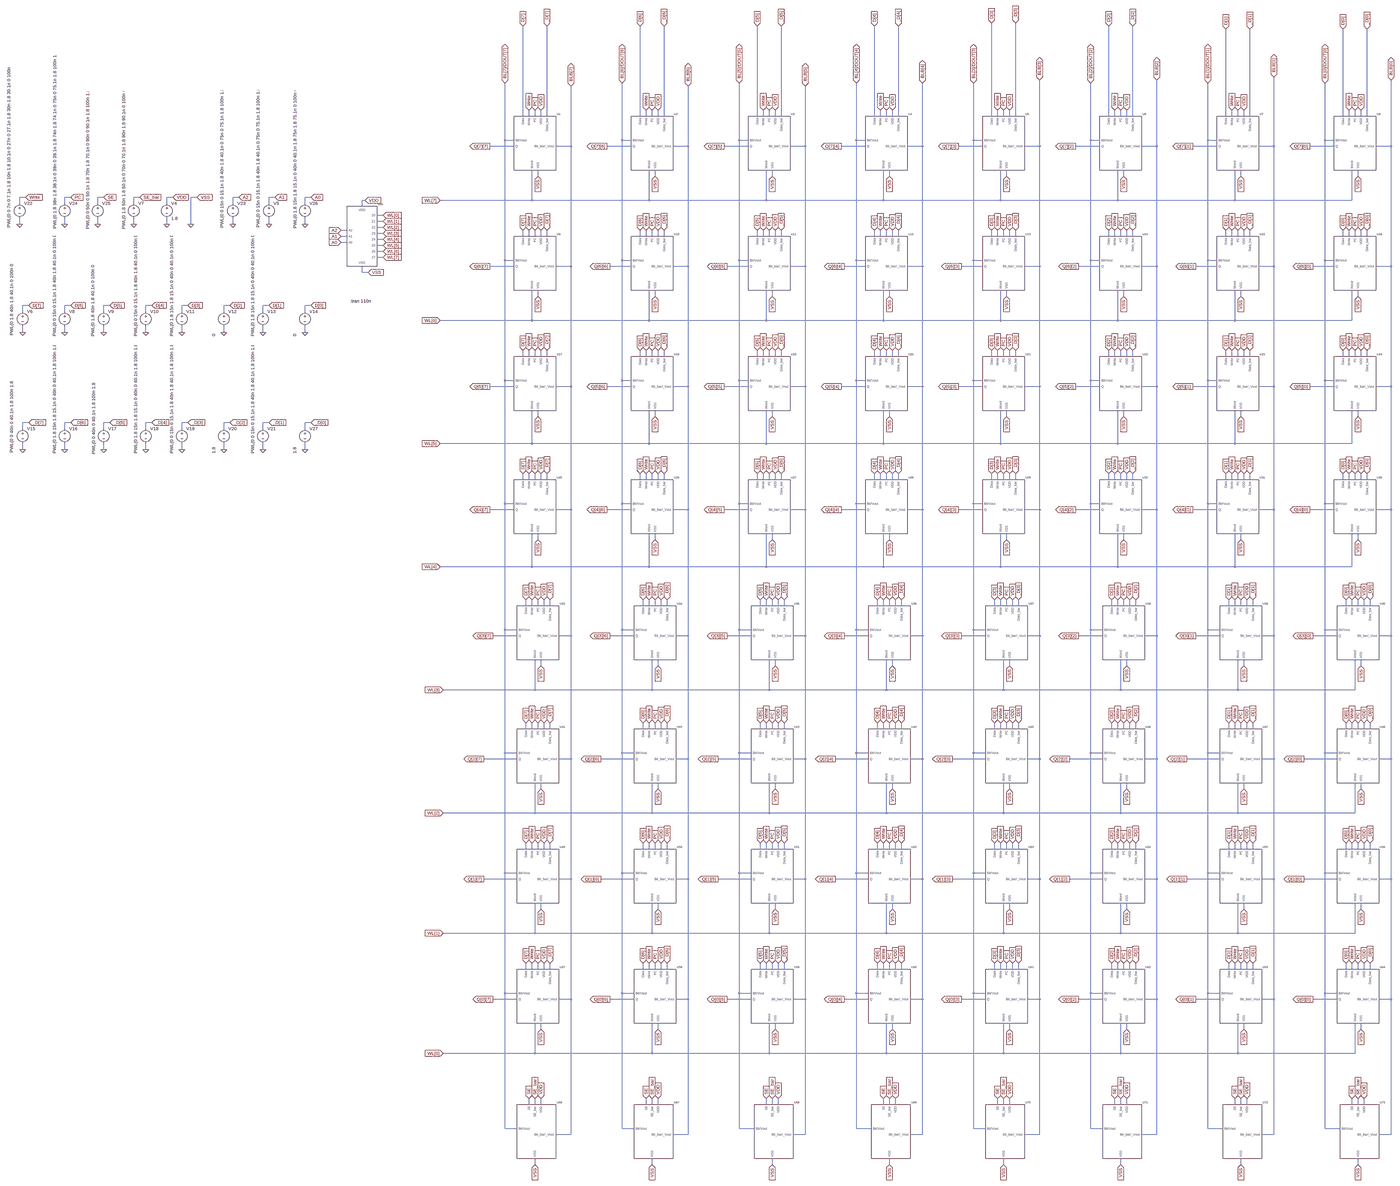
[diagram p0: schematic 8x8_Array.asc, whole sheet]
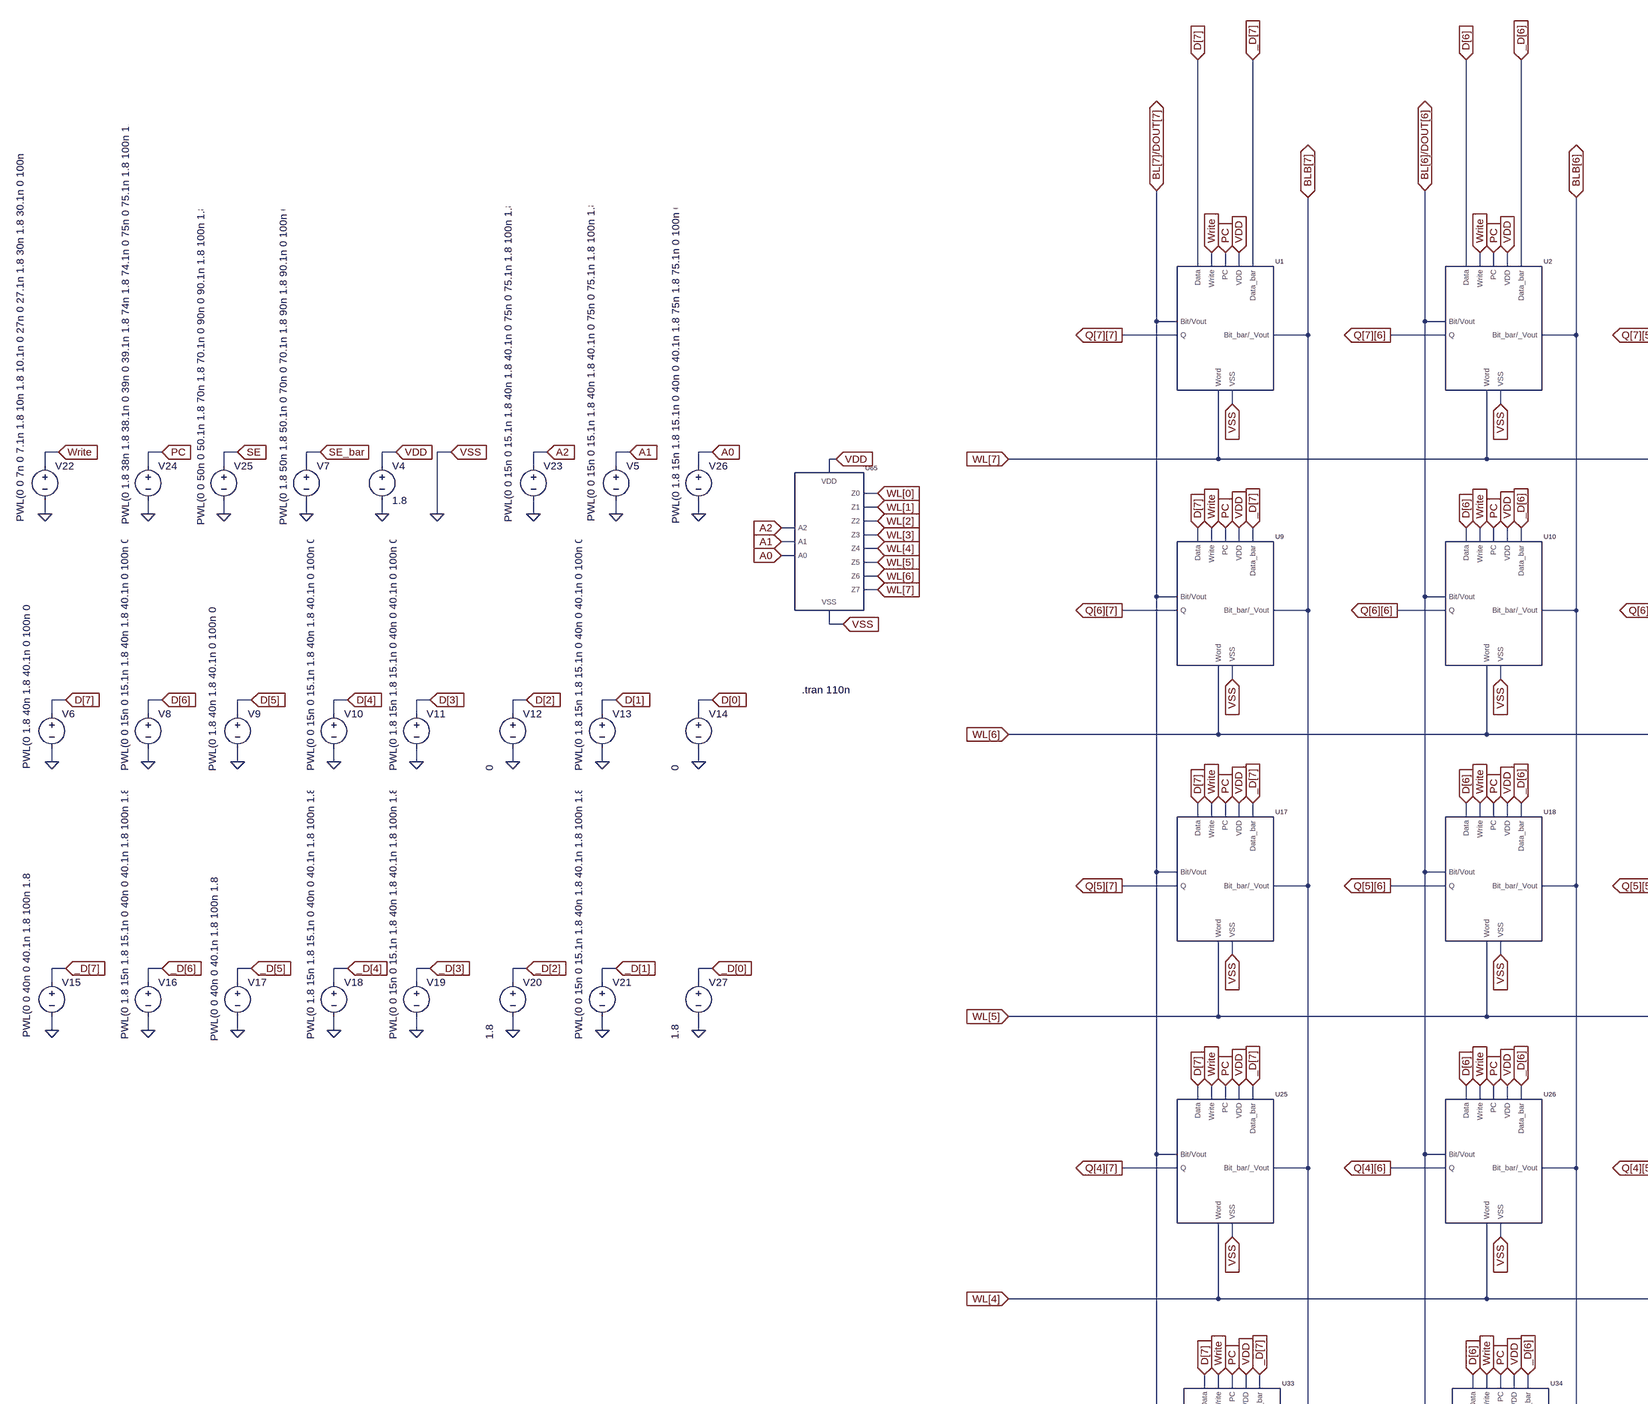
[diagram p1: schematic 8x8_Array.asc, part, row 1 of 2, column 1 of 2]
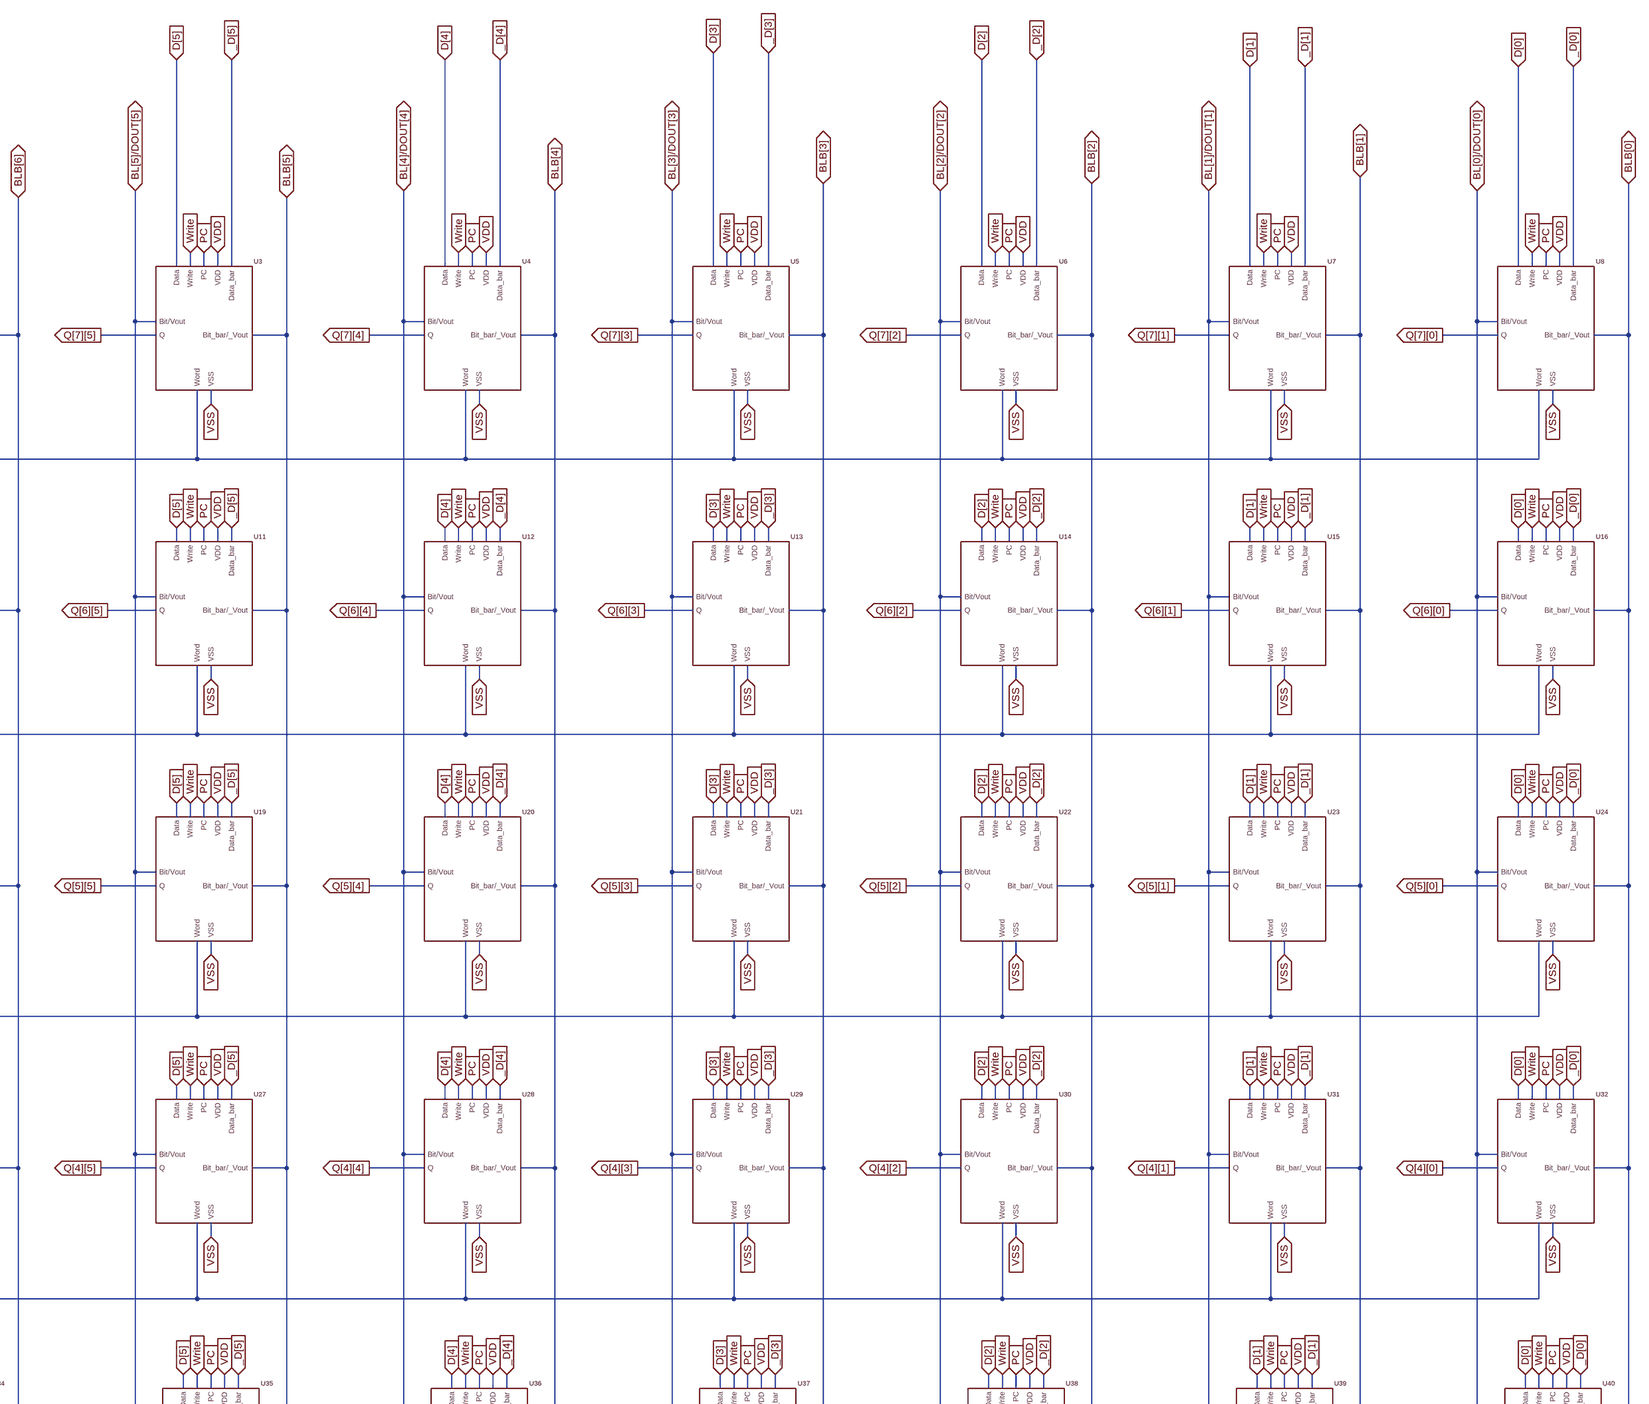
[diagram p2: schematic 8x8_Array.asc, part, row 1 of 2, column 2 of 2]
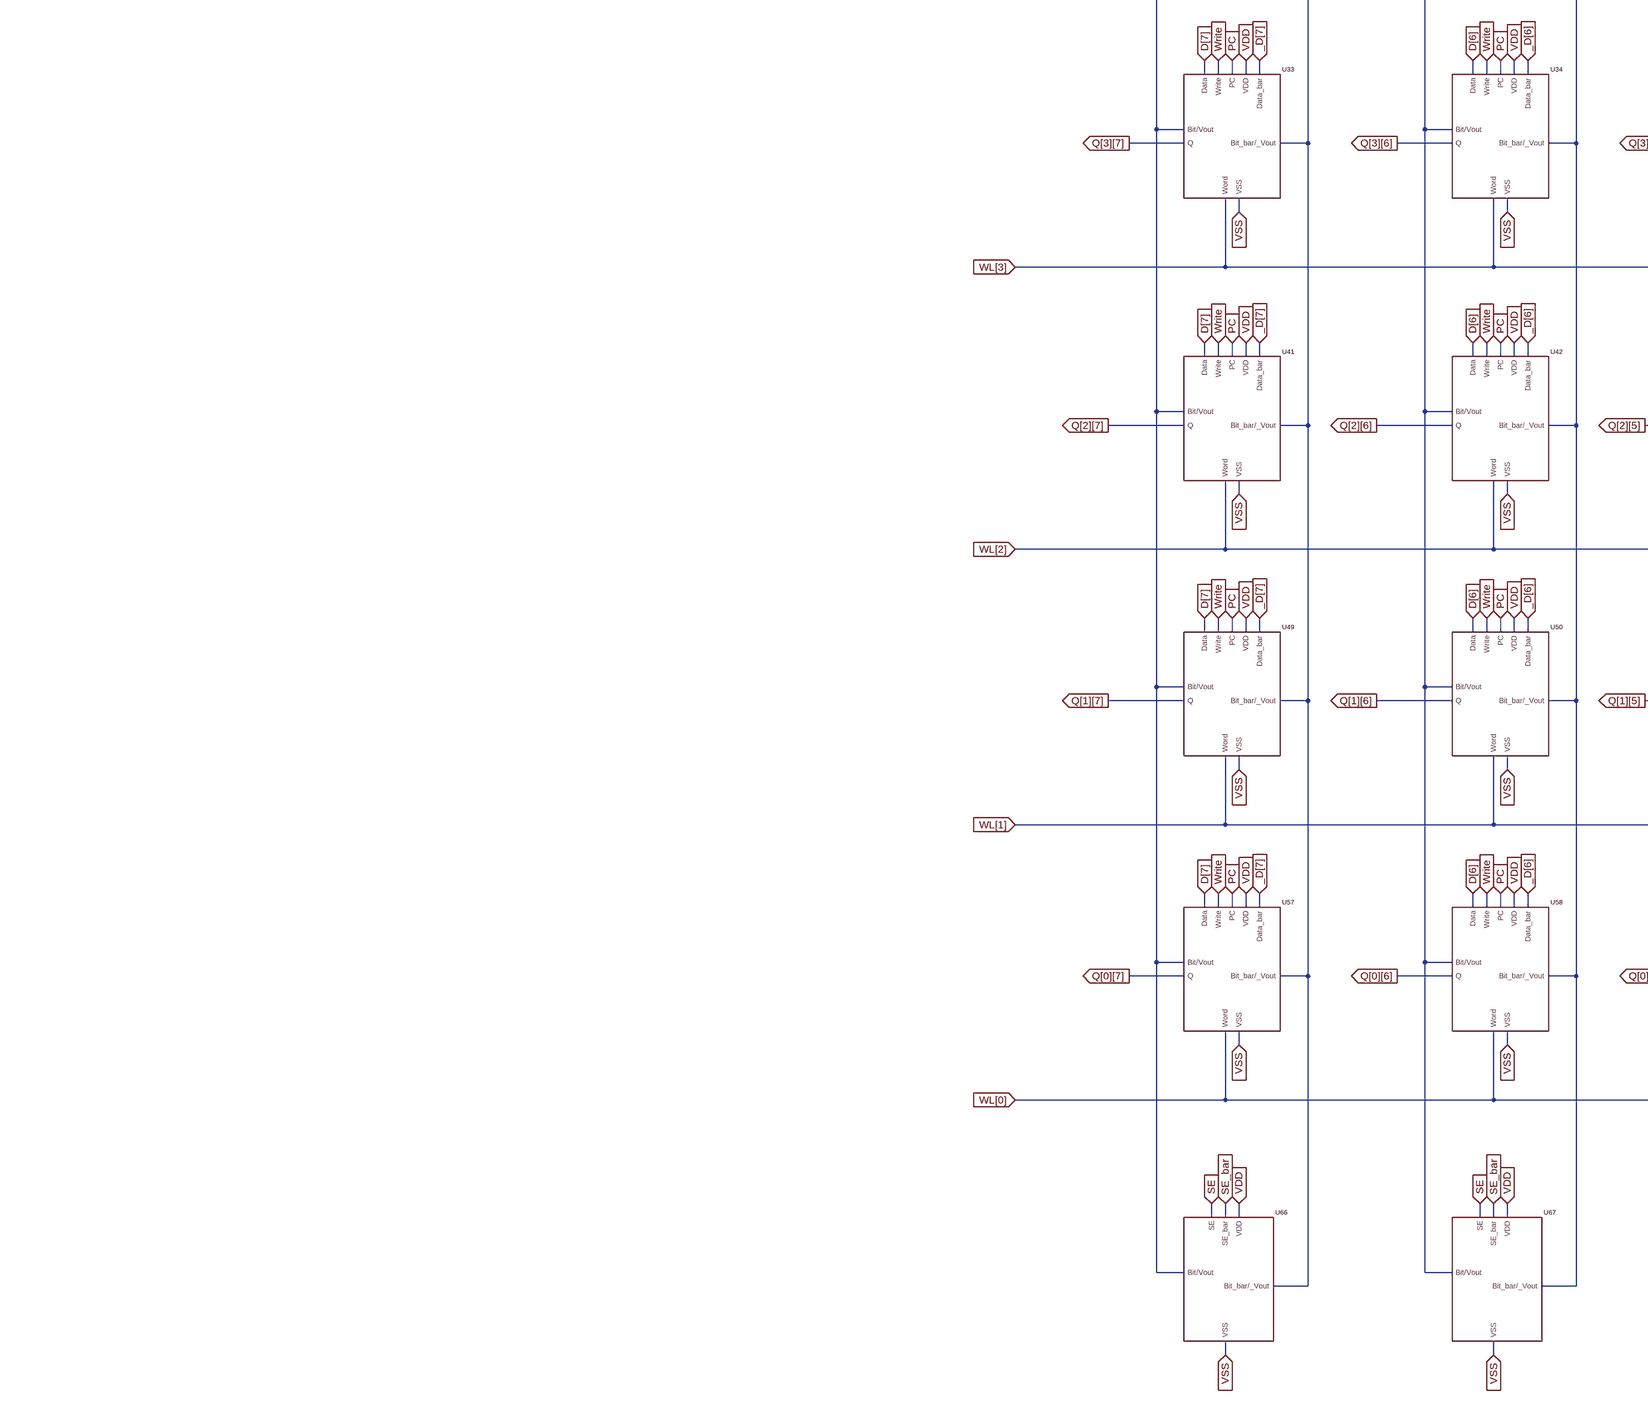
[diagram p3: schematic 8x8_Array.asc, part, row 2 of 2, column 1 of 2]
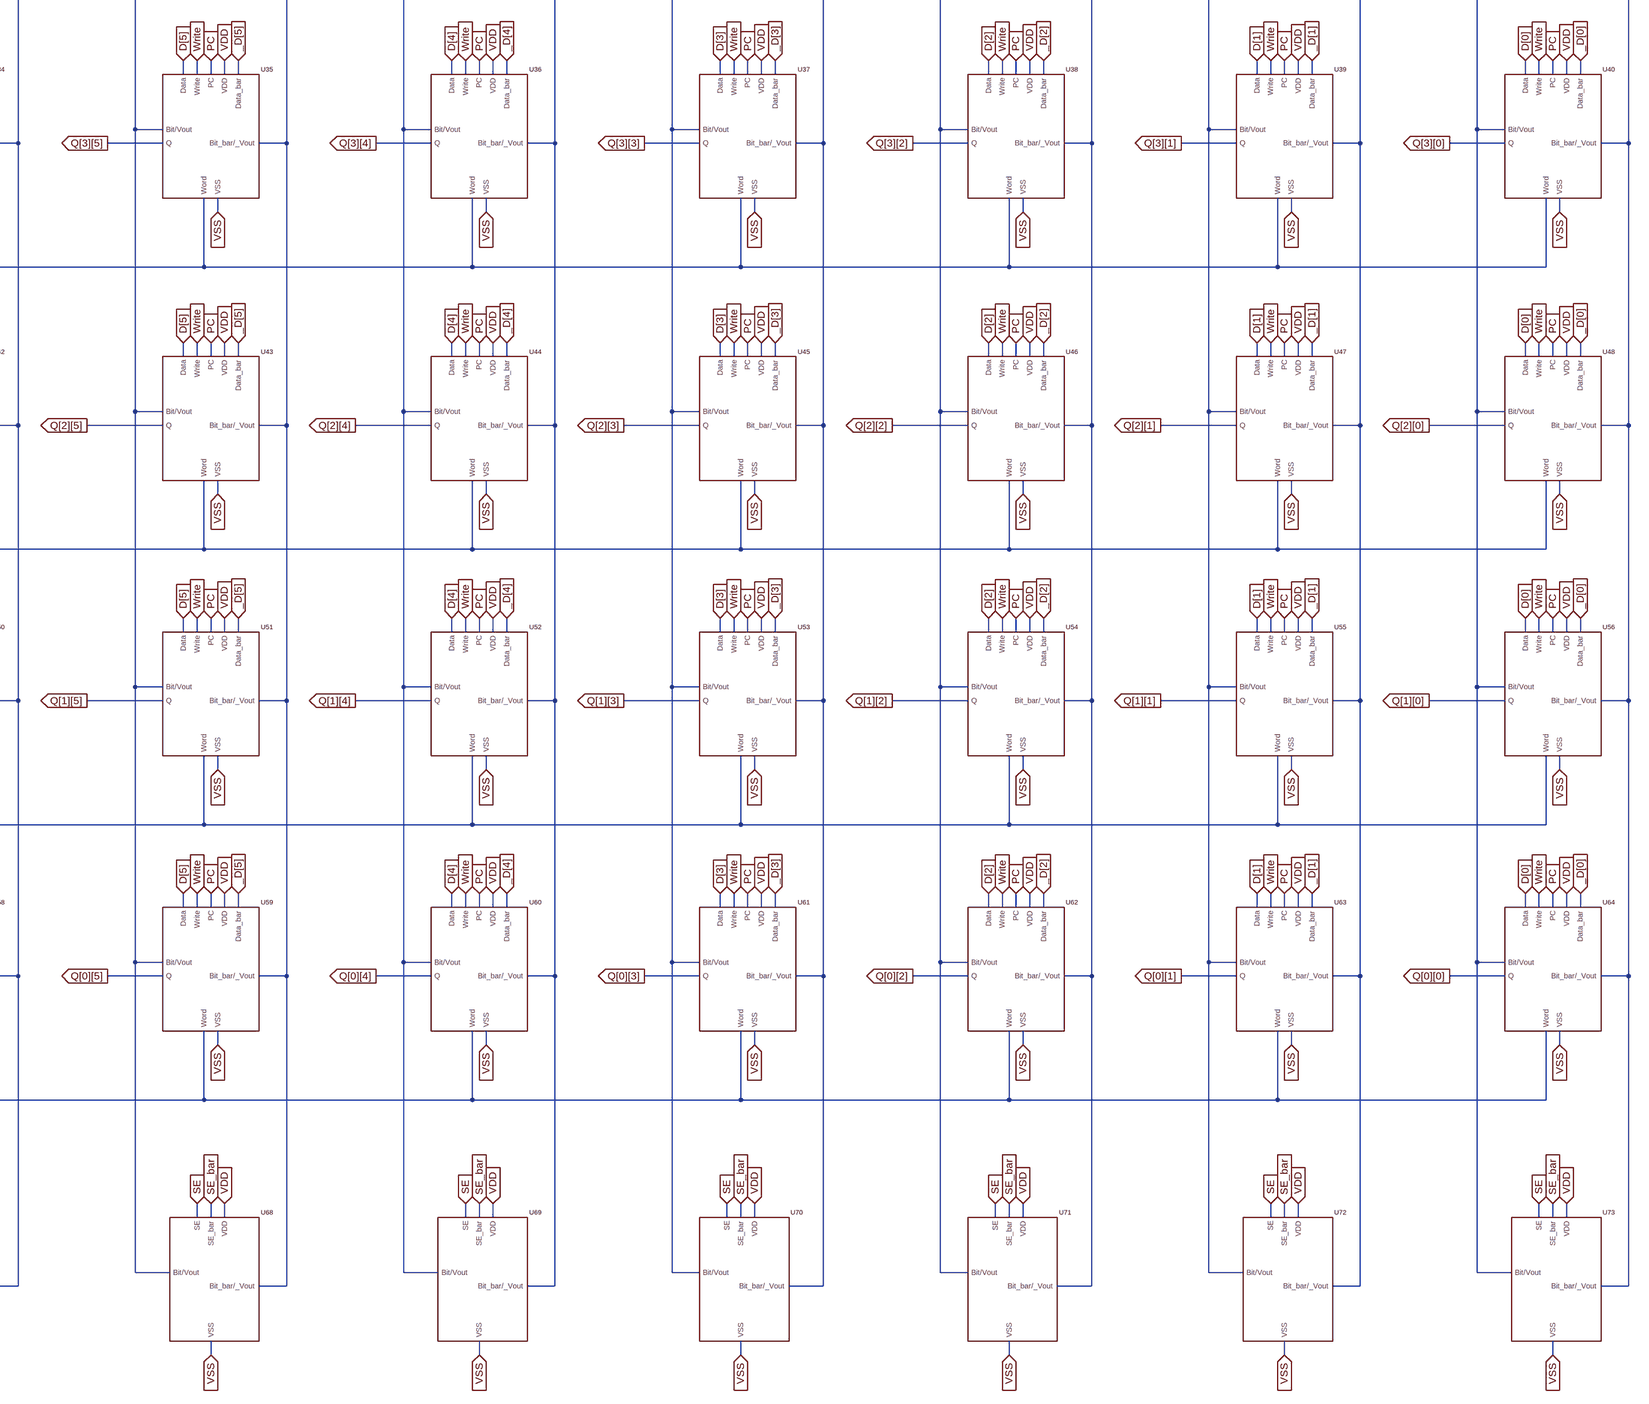
[diagram p4: schematic 8x8_Array.asc, part, row 2 of 2, column 2 of 2]
* 8x8_Array.asc
X§U1 D[7] Write PC VDD _D[7] WL[7] 0 BL[7]/DOUT[7] Q[7][7] BLB[7] 1-bit_6T_SRAM_Cell  ; pins Data Write PC VDD Data_bar Word VSS Bit/Vout Q Bit_bar/_Vout
X§U65 A2 A1 A0 WL[0] WL[1] WL[2] WL[3] WL[4] WL[5] WL[6] WL[7] VDD 0 3_to_8_Row_Decoder  ; pins A2 A1 A0 Z0 Z1 Z2 Z3 Z4 Z5 Z6 Z7 VDD VSS
X§U2 D[6] Write PC VDD _D[6] WL[7] 0 BL[6]/DOUT[6] Q[7][6] BLB[6] 1-bit_6T_SRAM_Cell  ; pins Data Write PC VDD Data_bar Word VSS Bit/Vout Q Bit_bar/_Vout
X§U3 D[5] Write PC VDD _D[5] WL[7] 0 BL[5]/DOUT[5] Q[7][5] BLB[5] 1-bit_6T_SRAM_Cell  ; pins Data Write PC VDD Data_bar Word VSS Bit/Vout Q Bit_bar/_Vout
X§U4 D[4] Write PC VDD _D[4] WL[7] 0 BL[4]/DOUT[4] Q[7][4] BLB[4] 1-bit_6T_SRAM_Cell  ; pins Data Write PC VDD Data_bar Word VSS Bit/Vout Q Bit_bar/_Vout
X§U5 D[3] Write PC VDD _D[3] WL[7] 0 BL[3]/DOUT[3] Q[7][3] BLB[3] 1-bit_6T_SRAM_Cell  ; pins Data Write PC VDD Data_bar Word VSS Bit/Vout Q Bit_bar/_Vout
X§U6 D[2] Write PC VDD _D[2] WL[7] 0 BL[2]/DOUT[2] Q[7][2] BLB[2] 1-bit_6T_SRAM_Cell  ; pins Data Write PC VDD Data_bar Word VSS Bit/Vout Q Bit_bar/_Vout
X§U7 D[1] Write PC VDD _D[1] WL[7] 0 BL[1]/DOUT[1] Q[7][1] BLB[1] 1-bit_6T_SRAM_Cell  ; pins Data Write PC VDD Data_bar Word VSS Bit/Vout Q Bit_bar/_Vout
X§U8 D[0] Write PC VDD _D[0] WL[7] 0 BL[0]/DOUT[0] Q[7][0] BLB[0] 1-bit_6T_SRAM_Cell  ; pins Data Write PC VDD Data_bar Word VSS Bit/Vout Q Bit_bar/_Vout
X§U9 D[7] Write PC VDD _D[7] WL[6] 0 BL[7]/DOUT[7] Q[6][7] BLB[7] 1-bit_6T_SRAM_Cell  ; pins Data Write PC VDD Data_bar Word VSS Bit/Vout Q Bit_bar/_Vout
X§U10 D[6] Write PC VDD _D[6] WL[6] 0 BL[6]/DOUT[6] Q[6][6] BLB[6] 1-bit_6T_SRAM_Cell  ; pins Data Write PC VDD Data_bar Word VSS Bit/Vout Q Bit_bar/_Vout
X§U11 D[5] Write PC VDD _D[5] WL[6] 0 BL[5]/DOUT[5] Q[6][5] BLB[5] 1-bit_6T_SRAM_Cell  ; pins Data Write PC VDD Data_bar Word VSS Bit/Vout Q Bit_bar/_Vout
X§U12 D[4] Write PC VDD _D[4] WL[6] 0 BL[4]/DOUT[4] Q[6][4] BLB[4] 1-bit_6T_SRAM_Cell  ; pins Data Write PC VDD Data_bar Word VSS Bit/Vout Q Bit_bar/_Vout
X§U13 D[3] Write PC VDD _D[3] WL[6] 0 BL[3]/DOUT[3] Q[6][3] BLB[3] 1-bit_6T_SRAM_Cell  ; pins Data Write PC VDD Data_bar Word VSS Bit/Vout Q Bit_bar/_Vout
X§U14 D[2] Write PC VDD _D[2] WL[6] 0 BL[2]/DOUT[2] Q[6][2] BLB[2] 1-bit_6T_SRAM_Cell  ; pins Data Write PC VDD Data_bar Word VSS Bit/Vout Q Bit_bar/_Vout
X§U15 D[1] Write PC VDD _D[1] WL[6] 0 BL[1]/DOUT[1] Q[6][1] BLB[1] 1-bit_6T_SRAM_Cell  ; pins Data Write PC VDD Data_bar Word VSS Bit/Vout Q Bit_bar/_Vout
X§U16 D[0] Write PC VDD _D[0] WL[6] 0 BL[0]/DOUT[0] Q[6][0] BLB[0] 1-bit_6T_SRAM_Cell  ; pins Data Write PC VDD Data_bar Word VSS Bit/Vout Q Bit_bar/_Vout
X§U17 D[7] Write PC VDD _D[7] WL[5] 0 BL[7]/DOUT[7] Q[5][7] BLB[7] 1-bit_6T_SRAM_Cell  ; pins Data Write PC VDD Data_bar Word VSS Bit/Vout Q Bit_bar/_Vout
X§U18 D[6] Write PC VDD _D[6] WL[5] 0 BL[6]/DOUT[6] Q[5][6] BLB[6] 1-bit_6T_SRAM_Cell  ; pins Data Write PC VDD Data_bar Word VSS Bit/Vout Q Bit_bar/_Vout
X§U19 D[5] Write PC VDD _D[5] WL[5] 0 BL[5]/DOUT[5] Q[5][5] BLB[5] 1-bit_6T_SRAM_Cell  ; pins Data Write PC VDD Data_bar Word VSS Bit/Vout Q Bit_bar/_Vout
X§U20 D[4] Write PC VDD _D[4] WL[5] 0 BL[4]/DOUT[4] Q[5][4] BLB[4] 1-bit_6T_SRAM_Cell  ; pins Data Write PC VDD Data_bar Word VSS Bit/Vout Q Bit_bar/_Vout
X§U21 D[3] Write PC VDD _D[3] WL[5] 0 BL[3]/DOUT[3] Q[5][3] BLB[3] 1-bit_6T_SRAM_Cell  ; pins Data Write PC VDD Data_bar Word VSS Bit/Vout Q Bit_bar/_Vout
X§U22 D[2] Write PC VDD _D[2] WL[5] 0 BL[2]/DOUT[2] Q[5][2] BLB[2] 1-bit_6T_SRAM_Cell  ; pins Data Write PC VDD Data_bar Word VSS Bit/Vout Q Bit_bar/_Vout
X§U23 D[1] Write PC VDD _D[1] WL[5] 0 BL[1]/DOUT[1] Q[5][1] BLB[1] 1-bit_6T_SRAM_Cell  ; pins Data Write PC VDD Data_bar Word VSS Bit/Vout Q Bit_bar/_Vout
X§U24 D[0] Write PC VDD _D[0] WL[5] 0 BL[0]/DOUT[0] Q[5][0] BLB[0] 1-bit_6T_SRAM_Cell  ; pins Data Write PC VDD Data_bar Word VSS Bit/Vout Q Bit_bar/_Vout
X§U25 D[7] Write PC VDD _D[7] WL[4] 0 BL[7]/DOUT[7] Q[4][7] BLB[7] 1-bit_6T_SRAM_Cell  ; pins Data Write PC VDD Data_bar Word VSS Bit/Vout Q Bit_bar/_Vout
X§U26 D[6] Write PC VDD _D[6] WL[4] 0 BL[6]/DOUT[6] Q[4][6] BLB[6] 1-bit_6T_SRAM_Cell  ; pins Data Write PC VDD Data_bar Word VSS Bit/Vout Q Bit_bar/_Vout
X§U27 D[5] Write PC VDD _D[5] WL[4] 0 BL[5]/DOUT[5] Q[4][5] BLB[5] 1-bit_6T_SRAM_Cell  ; pins Data Write PC VDD Data_bar Word VSS Bit/Vout Q Bit_bar/_Vout
X§U28 D[4] Write PC VDD _D[4] WL[4] 0 BL[4]/DOUT[4] Q[4][4] BLB[4] 1-bit_6T_SRAM_Cell  ; pins Data Write PC VDD Data_bar Word VSS Bit/Vout Q Bit_bar/_Vout
X§U29 D[3] Write PC VDD _D[3] WL[4] 0 BL[3]/DOUT[3] Q[4][3] BLB[3] 1-bit_6T_SRAM_Cell  ; pins Data Write PC VDD Data_bar Word VSS Bit/Vout Q Bit_bar/_Vout
X§U30 D[2] Write PC VDD _D[2] WL[4] 0 BL[2]/DOUT[2] Q[4][2] BLB[2] 1-bit_6T_SRAM_Cell  ; pins Data Write PC VDD Data_bar Word VSS Bit/Vout Q Bit_bar/_Vout
X§U31 D[1] Write PC VDD _D[1] WL[4] 0 BL[1]/DOUT[1] Q[4][1] BLB[1] 1-bit_6T_SRAM_Cell  ; pins Data Write PC VDD Data_bar Word VSS Bit/Vout Q Bit_bar/_Vout
X§U32 D[0] Write PC VDD _D[0] WL[4] 0 BL[0]/DOUT[0] Q[4][0] BLB[0] 1-bit_6T_SRAM_Cell  ; pins Data Write PC VDD Data_bar Word VSS Bit/Vout Q Bit_bar/_Vout
X§U33 D[7] Write PC VDD _D[7] WL[3] 0 BL[7]/DOUT[7] Q[3][7] BLB[7] 1-bit_6T_SRAM_Cell  ; pins Data Write PC VDD Data_bar Word VSS Bit/Vout Q Bit_bar/_Vout
X§U34 D[6] Write PC VDD _D[6] WL[3] 0 BL[6]/DOUT[6] Q[3][6] BLB[6] 1-bit_6T_SRAM_Cell  ; pins Data Write PC VDD Data_bar Word VSS Bit/Vout Q Bit_bar/_Vout
X§U35 D[5] Write PC VDD _D[5] WL[3] 0 BL[5]/DOUT[5] Q[3][5] BLB[5] 1-bit_6T_SRAM_Cell  ; pins Data Write PC VDD Data_bar Word VSS Bit/Vout Q Bit_bar/_Vout
X§U36 D[4] Write PC VDD _D[4] WL[3] 0 BL[4]/DOUT[4] Q[3][4] BLB[4] 1-bit_6T_SRAM_Cell  ; pins Data Write PC VDD Data_bar Word VSS Bit/Vout Q Bit_bar/_Vout
X§U37 D[3] Write PC VDD _D[3] WL[3] 0 BL[3]/DOUT[3] Q[3][3] BLB[3] 1-bit_6T_SRAM_Cell  ; pins Data Write PC VDD Data_bar Word VSS Bit/Vout Q Bit_bar/_Vout
X§U38 D[2] Write PC VDD _D[2] WL[3] 0 BL[2]/DOUT[2] Q[3][2] BLB[2] 1-bit_6T_SRAM_Cell  ; pins Data Write PC VDD Data_bar Word VSS Bit/Vout Q Bit_bar/_Vout
X§U39 D[1] Write PC VDD _D[1] WL[3] 0 BL[1]/DOUT[1] Q[3][1] BLB[1] 1-bit_6T_SRAM_Cell  ; pins Data Write PC VDD Data_bar Word VSS Bit/Vout Q Bit_bar/_Vout
X§U40 D[0] Write PC VDD _D[0] WL[3] 0 BL[0]/DOUT[0] Q[3][0] BLB[0] 1-bit_6T_SRAM_Cell  ; pins Data Write PC VDD Data_bar Word VSS Bit/Vout Q Bit_bar/_Vout
X§U41 D[7] Write PC VDD _D[7] WL[2] 0 BL[7]/DOUT[7] Q[2][7] BLB[7] 1-bit_6T_SRAM_Cell  ; pins Data Write PC VDD Data_bar Word VSS Bit/Vout Q Bit_bar/_Vout
X§U42 D[6] Write PC VDD _D[6] WL[2] 0 BL[6]/DOUT[6] Q[2][6] BLB[6] 1-bit_6T_SRAM_Cell  ; pins Data Write PC VDD Data_bar Word VSS Bit/Vout Q Bit_bar/_Vout
X§U43 D[5] Write PC VDD _D[5] WL[2] 0 BL[5]/DOUT[5] Q[2][5] BLB[5] 1-bit_6T_SRAM_Cell  ; pins Data Write PC VDD Data_bar Word VSS Bit/Vout Q Bit_bar/_Vout
X§U44 D[4] Write PC VDD _D[4] WL[2] 0 BL[4]/DOUT[4] Q[2][4] BLB[4] 1-bit_6T_SRAM_Cell  ; pins Data Write PC VDD Data_bar Word VSS Bit/Vout Q Bit_bar/_Vout
X§U45 D[3] Write PC VDD _D[3] WL[2] 0 BL[3]/DOUT[3] Q[2][3] BLB[3] 1-bit_6T_SRAM_Cell  ; pins Data Write PC VDD Data_bar Word VSS Bit/Vout Q Bit_bar/_Vout
X§U46 D[2] Write PC VDD _D[2] WL[2] 0 BL[2]/DOUT[2] Q[2][2] BLB[2] 1-bit_6T_SRAM_Cell  ; pins Data Write PC VDD Data_bar Word VSS Bit/Vout Q Bit_bar/_Vout
X§U47 D[1] Write PC VDD _D[1] WL[2] 0 BL[1]/DOUT[1] Q[2][1] BLB[1] 1-bit_6T_SRAM_Cell  ; pins Data Write PC VDD Data_bar Word VSS Bit/Vout Q Bit_bar/_Vout
X§U48 D[0] Write PC VDD _D[0] WL[2] 0 BL[0]/DOUT[0] Q[2][0] BLB[0] 1-bit_6T_SRAM_Cell  ; pins Data Write PC VDD Data_bar Word VSS Bit/Vout Q Bit_bar/_Vout
X§U49 D[7] Write PC VDD _D[7] WL[1] 0 BL[7]/DOUT[7] Q[1][7] BLB[7] 1-bit_6T_SRAM_Cell  ; pins Data Write PC VDD Data_bar Word VSS Bit/Vout Q Bit_bar/_Vout
X§U50 D[6] Write PC VDD _D[6] WL[1] 0 BL[6]/DOUT[6] Q[1][6] BLB[6] 1-bit_6T_SRAM_Cell  ; pins Data Write PC VDD Data_bar Word VSS Bit/Vout Q Bit_bar/_Vout
X§U51 D[5] Write PC VDD _D[5] WL[1] 0 BL[5]/DOUT[5] Q[1][5] BLB[5] 1-bit_6T_SRAM_Cell  ; pins Data Write PC VDD Data_bar Word VSS Bit/Vout Q Bit_bar/_Vout
X§U52 D[4] Write PC VDD _D[4] WL[1] 0 BL[4]/DOUT[4] Q[1][4] BLB[4] 1-bit_6T_SRAM_Cell  ; pins Data Write PC VDD Data_bar Word VSS Bit/Vout Q Bit_bar/_Vout
X§U53 D[3] Write PC VDD _D[3] WL[1] 0 BL[3]/DOUT[3] Q[1][3] BLB[3] 1-bit_6T_SRAM_Cell  ; pins Data Write PC VDD Data_bar Word VSS Bit/Vout Q Bit_bar/_Vout
X§U54 D[2] Write PC VDD _D[2] WL[1] 0 BL[2]/DOUT[2] Q[1][2] BLB[2] 1-bit_6T_SRAM_Cell  ; pins Data Write PC VDD Data_bar Word VSS Bit/Vout Q Bit_bar/_Vout
X§U55 D[1] Write PC VDD _D[1] WL[1] 0 BL[1]/DOUT[1] Q[1][1] BLB[1] 1-bit_6T_SRAM_Cell  ; pins Data Write PC VDD Data_bar Word VSS Bit/Vout Q Bit_bar/_Vout
X§U56 D[0] Write PC VDD _D[0] WL[1] 0 BL[0]/DOUT[0] Q[1][0] BLB[0] 1-bit_6T_SRAM_Cell  ; pins Data Write PC VDD Data_bar Word VSS Bit/Vout Q Bit_bar/_Vout
X§U57 D[7] Write PC VDD _D[7] WL[0] 0 BL[7]/DOUT[7] Q[0][7] BLB[7] 1-bit_6T_SRAM_Cell  ; pins Data Write PC VDD Data_bar Word VSS Bit/Vout Q Bit_bar/_Vout
X§U58 D[6] Write PC VDD _D[6] WL[0] 0 BL[6]/DOUT[6] Q[0][6] BLB[6] 1-bit_6T_SRAM_Cell  ; pins Data Write PC VDD Data_bar Word VSS Bit/Vout Q Bit_bar/_Vout
X§U59 D[5] Write PC VDD _D[5] WL[0] 0 BL[5]/DOUT[5] Q[0][5] BLB[5] 1-bit_6T_SRAM_Cell  ; pins Data Write PC VDD Data_bar Word VSS Bit/Vout Q Bit_bar/_Vout
X§U60 D[4] Write PC VDD _D[4] WL[0] 0 BL[4]/DOUT[4] Q[0][4] BLB[4] 1-bit_6T_SRAM_Cell  ; pins Data Write PC VDD Data_bar Word VSS Bit/Vout Q Bit_bar/_Vout
X§U61 D[3] Write PC VDD _D[3] WL[0] 0 BL[3]/DOUT[3] Q[0][3] BLB[3] 1-bit_6T_SRAM_Cell  ; pins Data Write PC VDD Data_bar Word VSS Bit/Vout Q Bit_bar/_Vout
X§U62 D[2] Write PC VDD _D[2] WL[0] 0 BL[2]/DOUT[2] Q[0][2] BLB[2] 1-bit_6T_SRAM_Cell  ; pins Data Write PC VDD Data_bar Word VSS Bit/Vout Q Bit_bar/_Vout
X§U63 D[1] Write PC VDD _D[1] WL[0] 0 BL[1]/DOUT[1] Q[0][1] BLB[1] 1-bit_6T_SRAM_Cell  ; pins Data Write PC VDD Data_bar Word VSS Bit/Vout Q Bit_bar/_Vout
X§U64 D[0] Write PC VDD _D[0] WL[0] 0 BL[0]/DOUT[0] Q[0][0] BLB[0] 1-bit_6T_SRAM_Cell  ; pins Data Write PC VDD Data_bar Word VSS Bit/Vout Q Bit_bar/_Vout
X§U66 SE SE_bar VDD BL[7]/DOUT[7] BLB[7] 0 Sense_Amplifier  ; pins SE SE_bar VDD Bit/Vout Bit_bar/_Vout VSS
X§U67 SE SE_bar VDD BL[6]/DOUT[6] BLB[6] 0 Sense_Amplifier  ; pins SE SE_bar VDD Bit/Vout Bit_bar/_Vout VSS
X§U68 SE SE_bar VDD BL[5]/DOUT[5] BLB[5] 0 Sense_Amplifier  ; pins SE SE_bar VDD Bit/Vout Bit_bar/_Vout VSS
X§U69 SE SE_bar VDD BL[4]/DOUT[4] BLB[4] 0 Sense_Amplifier  ; pins SE SE_bar VDD Bit/Vout Bit_bar/_Vout VSS
X§U70 SE SE_bar VDD BL[3]/DOUT[3] BLB[3] 0 Sense_Amplifier  ; pins SE SE_bar VDD Bit/Vout Bit_bar/_Vout VSS
X§U71 SE SE_bar VDD BL[2]/DOUT[2] BLB[2] 0 Sense_Amplifier  ; pins SE SE_bar VDD Bit/Vout Bit_bar/_Vout VSS
X§U72 SE SE_bar VDD BL[1]/DOUT[1] BLB[1] 0 Sense_Amplifier  ; pins SE SE_bar VDD Bit/Vout Bit_bar/_Vout VSS
X§U73 SE SE_bar VDD BL[0]/DOUT[0] BLB[0] 0 Sense_Amplifier  ; pins SE SE_bar VDD Bit/Vout Bit_bar/_Vout VSS
V4 VDD 0 1.8
V22 Write 0 PWL(0 0 7n 0 7.1n 1.8 10n 1.8 10.1n 0 27n 0 27.1n 1.8 30n 1.8 30.1n 0 100n 0)
V24 PC 0 PWL(0 1.8 38n 1.8 38.1n 0 39n 0 39.1n 1.8 74n 1.8 74.1n 0 75n 0 75.1n 1.8 100n 1.8)
V25 SE 0 PWL(0 0 50n 0 50.1n 1.8 70n 1.8 70.1n 0 90n 0 90.1n 1.8 100n 1.8)
V8 D[6] 0 PWL(0 0 15n 0 15.1n 1.8 40n 1.8 40.1n 0 100n 0)
V12 D[2] 0 0
V14 D[0] 0 0
V20 _D[2] 0 1.8
V27 _D[0] 0 1.8
V7 SE_bar 0 PWL(0 1.8 50n 1.8 50.1n 0 70n 0 70.1n 1.8 90n 1.8 90.1n 0 100n 0)
V6 D[7] 0 PWL(0 1.8 40n 1.8 40.1n 0 100n 0)
V9 D[5] 0 PWL(0 1.8 40n 1.8 40.1n 0 100n 0)
V10 D[4] 0 PWL(0 0 15n 0 15.1n 1.8 40n 1.8 40.1n 0 100n 0)
V11 D[3] 0 PWL(0 1.8 15n 1.8 15.1n 0 40n 0 40.1n 0 100n 0)
V13 D[1] 0 PWL(0 1.8 15n 1.8 15.1n 0 40n 0 40.1n 0 100n 0)
V15 _D[7] 0 PWL(0 0 40n 0 40.1n 1.8 100n 1.8)
V16 _D[6] 0 PWL(0 1.8 15n 1.8 15.1n 0 40n 0 40.1n 1.8 100n 1.8)
V17 _D[5] 0 PWL(0 0 40n 0 40.1n 1.8 100n 1.8)
V18 _D[4] 0 PWL(0 1.8 15n 1.8 15.1n 0 40n 0 40.1n 1.8 100n 1.8)
V19 _D[3] 0 PWL(0 0 15n 0 15.1n 1.8 40n 1.8 40.1n 1.8 100n 1.8)
V21 _D[1] 0 PWL(0 0 15n 0 15.1n 1.8 40n 1.8 40.1n 1.8 100n 1.8)
V5 A1 0 PWL(0 0 15n 0 15.1n 1.8 40n 1.8 40.1n 0 75n 0 75.1n 1.8 100n 1.8)
V23 A2 0 PWL(0 0 15n 0 15.1n 1.8 40n 1.8 40.1n 0 75n 0 75.1n 1.8 100n 1.8)
V26 A0 0 PWL(0 1.8 15n 1.8 15.1n 0 40n 0 40.1n 1.8 75n 1.8 75.1n 0 100n 0)
.tran 110n
.lib 1-bit_6T_SRAM_Cell.sub
.lib 3_to_8_Row_Decoder.sub
.lib Sense_Amplifier.sub
.backanno
.end